# Altium project ChirpWear.PrjPCB
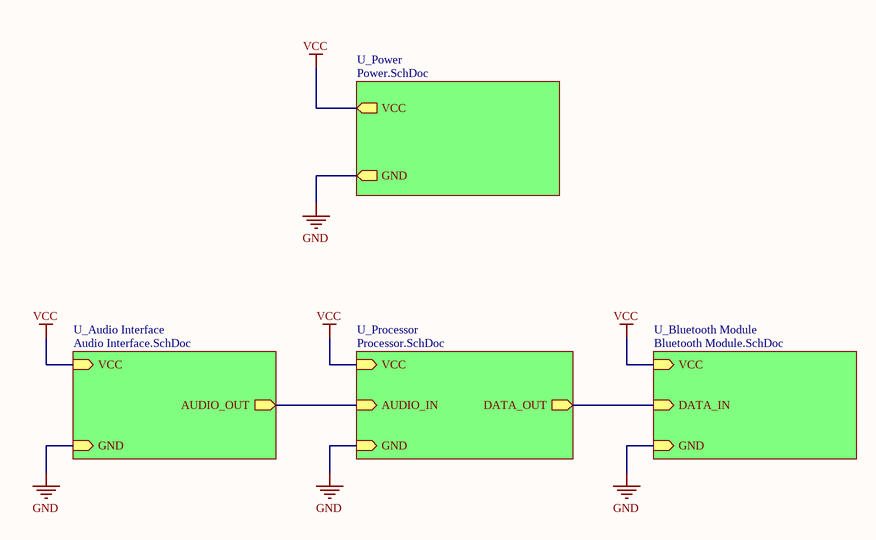
[diagram p0: Main.SchDoc]
5 sheets, 13 parts. Net scope: hierarchical (ports join the sheet entries above them; power ports are global).
Sheets:
  Main.SchDoc
    U_Audio Interface = Audio Interface.SchDoc
    U_Bluetooth Module = Bluetooth Module.SchDoc
    U_Power = Power.SchDoc
    U_Processor = Processor.SchDoc

## Sheet Main.SchDoc
size A3

### Sub-sheets
U_Audio Interface = Audio Interface.SchDoc: VCC (in), GND (in), AUDIO_OUT (out)
U_Bluetooth Module = Bluetooth Module.SchDoc: VCC (in), DATA_IN (in), GND (in)
U_Power = Power.SchDoc: GND (out), VCC (out)
U_Processor = Processor.SchDoc: VCC (in), GND (in), AUDIO_IN (in), DATA_OUT (out)

### Nets
GND: sheet U_Audio Interface/GND, sheet U_Bluetooth Module/GND, sheet U_Power/GND, sheet U_Processor/GND
VCC: sheet U_Audio Interface/VCC, sheet U_Bluetooth Module/VCC, sheet U_Power/VCC, sheet U_Processor/VCC
(unnamed): sheet U_Audio Interface/AUDIO_OUT, sheet U_Processor/AUDIO_IN
(unnamed): sheet U_Bluetooth Module/DATA_IN, sheet U_Processor/DATA_OUT

## Sheet Audio Interface.SchDoc
size A3
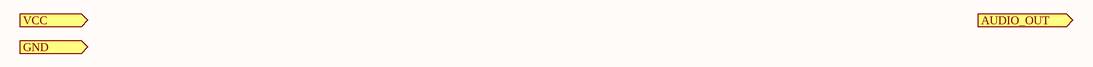
[diagram p1: Audio Interface.SchDoc]

### Ports
AUDIO_OUT (out), GND (in), VCC (in)

## Sheet Bluetooth Module.SchDoc
size A3
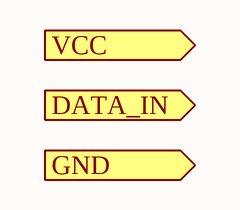
[diagram p2: Bluetooth Module.SchDoc]

### Ports
DATA_IN (in), GND (in), VCC (in)

## Sheet Power.SchDoc
size A3
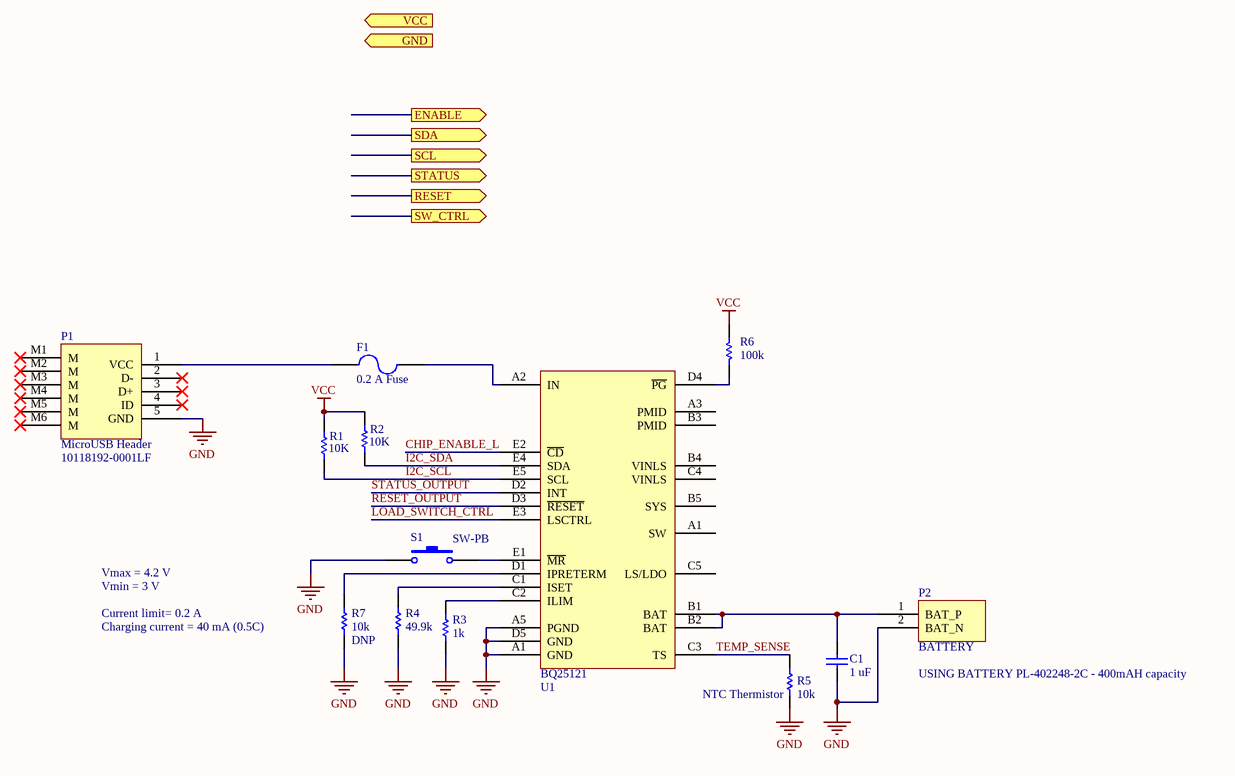
[diagram p3: Power.SchDoc]

### Parts
C1  value 1 uF  [1608[0603]]  (hidden comment: Cap)
F1  0.2 A Fuse  [Fuse_0603]
P1  MicroUSB Header  Manufacturer PN: 10118192-0001LF  [Micro USB B]
P2  BATTERY
R1  value 10K  [RES0603]  (hidden comment: Res1)
R2  value 10K  [RES0603]  (hidden comment: Res1)
R3  value 1k  [RES0603]  (hidden comment: Res1)
R4  value 49.9k  [RES0603]  (hidden comment: Res1)
R5  value 10k  [AXIAL-0.3]  (hidden comment: Res1)
R6  value 100k  [RES0603]  (hidden comment: Res1)
R7  value 10k  NO_STUFF: DNP  [AXIAL-0.3]  (hidden comment: Res1)
S1  SW-PB  [SPST-2]
U1  BQ25121

### Ports
ENABLE (out), GND (out), RESET (out), SCL (out), SDA (out), STATUS (out), SW_CTRL (out), VCC (out)

### Nets
GND: C1.1 P1.5(GND) P2.2(BAT_N) R3.1 R4.1 R5.1 R7.1 S1.1 U1.A1(GND) U1.A5(PGND) U1.D5(GND) ; port GND
VCC: R1.2 R2.2 R6.2 ; port VCC
CHIP_ENABLE_L: U1.E2(~{CD})
I2C_SCL: R1.1 U1.E5(SCL)
I2C_SDA: R2.1 U1.E4(SDA)
LOAD_SWITCH_CTRL: U1.E3(LSCTRL)
RESET_OUTPUT: U1.D3(~{RESET})
STATUS_OUTPUT: U1.D2(INT)
TEMP_SENSE: R5.2 U1.C3(TS)
NetC1_2: C1.2 P2.1(BAT_P) U1.B1(BAT) U1.B2(BAT)
NetF1_1: F1.1 P1.1(VCC)
NetF1_2: F1.2 U1.A2(IN)
NetR3_2: R3.2 U1.C2(ILIM)
NetR4_2: R4.2 U1.C1(ISET)
NetR6_1: R6.1 U1.D4(~{PG})
NetR7_2: R7.2 U1.D1(IPRETERM)
NetS1_2: S1.2 U1.E1(~{MR})

Not connected (* = marked no-connect by the designer): P1 2(D-)* 3(D+)* 4(ID)* M1(M)* M2(M)* M3(M)* M4(M)* M5(M)* M6(M)*; U1 A3(PMID) B3(PMID) B4(VINLS) B5(SYS) C4(VINLS) C5(LS/LDO)

### Notes on the sheet
- Vmax = 4.2 V
- Vmin = 3 V
- Current limit= 0.2 A
- Charging current = 40 mA (0.5C)
- (near P2) USING BATTERY PL-402248-2C - 400mAH capacity
- (near R5) NTC Thermistor

### Library data of the parts
C1 = Cap: Capacitor; Manufacturer PN: GRM188R70J105KA01D; Manufacturer: Murata; Digikey PN: 490-3898-1-ND
F1 = Fuse 2: Fuse; Manufacturer PN: F0603G0R20FNTR; Manufacturer: AVX; DIgikey PN: 478-6874-1-ND
P1 = Microusb: Manufacturer: Amphenol FCI; Digikey PN: 609-4613-1-ND
R1 R2 = Res1: Resistor; Manufacturer PN: RC0603JR-0710KL; Digikey PN: 311-10KGRCT-ND
R3 = Res1: Resistor; Manufacturer: Yageo; Manufacturer PN: RC0603FR-071KL; Tolerance: 1%; Power Rating: 0.1 W; Digikey PN: 311-1.00KHRCT-ND
R4 = Res1: Resistor; Manufacturer: Yageo; Manufacturer PN: RC0603FR-0749K9L; Tolerance: 1%; Power Rating: 0.1 W; Digikey PN: 311-49.9KHRCT-ND
R5 = Res1: Resistor; Manufacturer PN: NTCLE100E3103HB0; Digikey PN: BC2311-ND
R6 = Res1: Resistor; Manufacturer: Yageo; Manufacturer PN: RC0603FR-07100KL; Tolerance: 1%; Power Rating: 0.1 W; Digikey PN: 311-100KHRCT-ND
R7 = Res1: Resistor
S1 = SW-PB: Switch; Published: 24-Mar-1999; LatestRevisionDate: 17-Jul-2002; LatestRevisionNote: Re-released for DXP Platform.; PackageReference: SPST-2; Publisher: Altium Limited
U1 = BQ2512X: IC BATT CHG LI-ION 25DSBGA; Manufacturer: TI; Manufacturer PN: bq25121; Supplier PN: 296-44193-1-ND

## Sheet Processor.SchDoc
size A3
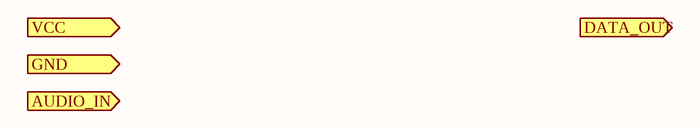
[diagram p4: Processor.SchDoc]

### Ports
AUDIO_IN (in), DATA_OUT (out), GND (in), VCC (in)